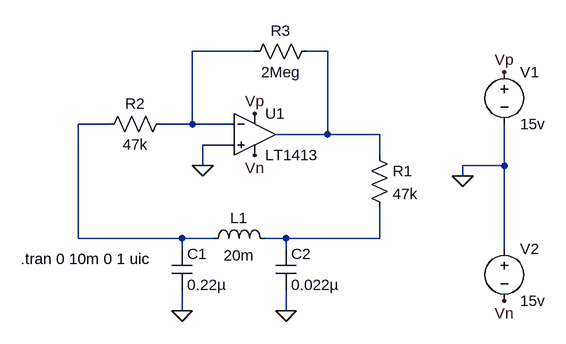
[diagram p0: schematic ec_exp4.asc]
ec_exp4.asc, the LTspice schematic file:
Version 4
SHEET 1 880 680
WIRE 224 -16 128 -16
WIRE 336 -16 304 -16
WIRE 0 96 -48 96
WIRE 128 96 128 -16
WIRE 128 96 80 96
WIRE 192 96 128 96
WIRE 336 112 336 -16
WIRE 336 112 256 112
WIRE 416 112 336 112
WIRE 192 128 144 128
WIRE 416 144 416 112
WIRE 144 160 144 128
WIRE 608 160 608 96
WIRE 608 160 544 160
WIRE 544 176 544 160
WIRE -48 272 -48 96
WIRE 112 272 -48 272
WIRE 160 272 112 272
WIRE 272 272 240 272
WIRE 416 272 416 224
WIRE 416 272 272 272
WIRE 112 288 112 272
WIRE 272 288 272 272
WIRE 608 288 608 160
WIRE 112 384 112 352
WIRE 272 384 272 352
FLAG 224 80 Vp
FLAG 224 144 Vn
FLAG 144 160 0
FLAG 112 384 0
FLAG 272 384 0
FLAG 544 176 0
FLAG 608 16 Vp
FLAG 608 368 Vn
SYMBOL res 400 128 R0
SYMATTR InstName R1
SYMATTR Value 47k
SYMBOL res 96 80 R90
WINDOW 0 0 56 VBottom 2
WINDOW 3 32 56 VTop 2
SYMATTR InstName R2
SYMATTR Value 47k
SYMBOL res 320 -32 R90
WINDOW 0 0 56 VBottom 2
WINDOW 3 32 56 VTop 2
SYMATTR InstName R3
SYMATTR Value 2Meg
SYMBOL OpAmps\\LT1413 224 48 R0
SYMATTR InstName U1
SYMBOL ind 144 288 R270
WINDOW 0 32 56 VTop 2
WINDOW 3 5 56 VBottom 2
SYMATTR InstName L1
SYMATTR Value 20m
SYMBOL cap 96 288 R0
SYMATTR InstName C1
SYMATTR Value 0.22µ
SYMBOL cap 256 288 R0
SYMATTR InstName C2
SYMATTR Value 0.022µ
SYMBOL voltage 608 0 R0
WINDOW 123 0 0 Left 0
WINDOW 39 0 0 Left 0
SYMATTR InstName V1
SYMATTR Value 15v
SYMBOL voltage 608 272 R0
WINDOW 123 0 0 Left 0
WINDOW 39 0 0 Left 0
SYMATTR InstName V2
SYMATTR Value 15v
TEXT -136 304 Left 2 !.tran 0 10m 0 1 uic

The netlist it stands for:
* ec_exp4.asc
R1 N002 N004 47k
R2 N001 N003 47k
R3 N002 N001 2Meg
XU1 0 N001 Vp Vn N002 LT1413  ; pins In+ In- V+ V- OUT
L1 N003 N004 20m
C1 N003 0 0.22µ
C2 N004 0 0.022µ
V1 Vp 0 15v
V2 0 Vn 15v
.tran 0 10m 0 1 uic
.lib LTC.lib
.backanno
.end